# Altium project soldeer.PrjPcb
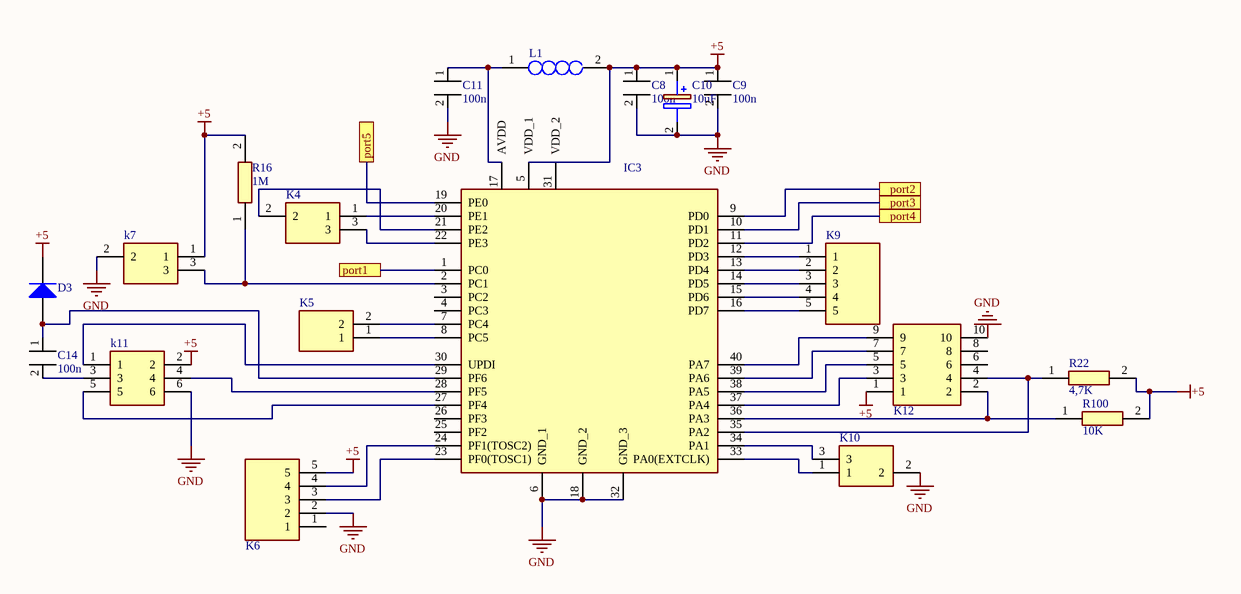
[diagram p0: controller.SchDoc]
4 sheets, 79 parts. Net scope: flat (ports and power ports of the same name join across sheets).
Board file: PCB1.PcbDoc
Sheets:
  controller.SchDoc
  input.SchDoc
  bout.SchDoc
  led.SchDoc

## Sheet controller.SchDoc
size A4; SheetNumber: 1; SheetTotal: 4

### Parts
C8  100n  [FP-CRCW0805-e3-IPC_A]
C9  100n  [FP-CRCW0805-e3-IPC_A]
C10  10uF  [RCE7U2J103J3K1H03B]
C11  100n  [FP-CRCW0805-e3-IPC_A]
C14  100n  [FP-CRCW0805-e3-IPC_A]
D3  1N4148  [NXP-SOD27-2_V]  (value not drawn)
IC3  ATMEGA4809-PF  [DIP1543W58P254L5175H635Q40N]  (value not drawn)
K4  10129380-903001ALF  [10129380903001ALF]  (value not drawn)
K5  M20-9990245  [HDRV2W64P0X254_1X2_508X254X864P]  (value not drawn)
K6  825433-5  [HDRV5W63P0X254_1X5_1270X254X970P]  (value not drawn)
k7  10129380-903001ALF  [10129380903001ALF]  (value not drawn)
K9  825433-5  [HDRV5W63P0X254_1X5_1270X254X970P]  (value not drawn)
K10  10129380-903001ALF  [10129380903001ALF]  (value not drawn)
k11  M22-5320305R  [M225320305R]  (value not drawn)
K12  61201021721  [SHDRRA10W64P254X254_2X5_2036X885X910P]  (value not drawn)
L1  LQM18FN1R0M00D  [LQM18FN100M00D]  (value not drawn)
R16  1M  [FP-CRCW0805-e3-IPC_A]
R22  4,7K  [FP-CRCW0805-e3-IPC_A]
R100  10K  [FP-CRCW0805-e3-IPC_A]

### Ports
port1, port2, port3, port4, port5

### Nets
+5: C8.1(+) C9.1(+) C10.1(+) D3.2(K) K6.5 k7.1 k11.2 K12.1 L1.2 R16.2 R22.2 R100.2
GND: C8.2(-) C9.2(-) C10.2(-) C11.2(-) IC3.6(GND_1) IC3.18(GND_2) IC3.32(GND_3) K6.2 k7.2 K10.2 k11.6 K12.10
NetC6_1: IC3.9(PD0) ; port port2
NetC11_1: C11.1(+) L1.1
NetC12_1: IC3.10(PD1) ; port port3
NetC14_1: C14.1(+) D3.1(A) IC3.29(PF6)
NetC14_2: C14.2(-) k11.3
NetD2_1: IC3.11(PD2) ; port port4
NetIC3_1: IC3.1(PC0) ; port port1
NetIC3_2: IC3.2(PC1) k7.3 R16.1
NetIC3_7: IC3.7(PC4) K5.2
NetIC3_8: IC3.8(PC5) K5.1
NetIC3_12: IC3.12(PD3) K9.1
NetIC3_13: IC3.13(PD4) K9.2
NetIC3_14: IC3.14(PD5) K9.3
NetIC3_15: IC3.15(PD6) K9.4
NetIC3_16: IC3.16(PD7) K9.5
NetIC3_19: IC3.19(PE0) ; port port5
NetIC3_20: IC3.20(PE1) K4.1
NetIC3_21: IC3.21(PE2) K4.2
NetIC3_22: IC3.22(PE3) K4.3
NetIC3_23: IC3.23(PF0(TOSC1)) K6.3
NetIC3_24: IC3.24(PF1(TOSC2)) K6.4
NetIC3_27: IC3.27(PF4) k11.5
NetIC3_28: IC3.28(PF5) k11.4
NetIC3_30: IC3.30(UPDI) k11.1
NetIC3_33: IC3.33(PA0(EXTCLK)) K10.1
NetIC3_34: IC3.34(PA1) K10.3
NetIC3_35: IC3.35(PA2) K12.4 R22.1
NetIC3_36: IC3.36(PA3) K12.2 R100.1
NetIC3_37: IC3.37(PA4) K12.3
NetIC3_38: IC3.38(PA5) K12.5
NetIC3_39: IC3.39(PA6) K12.7
NetIC3_40: IC3.40(PA7) K12.9

Not connected (* = marked no-connect by the designer): IC3 3(PC2) 4(PC3) 5(VDD_1) 17(AVDD) 25(PF2) 26(PF3) 31(VDD_2); K6 1; K12 6 8

### Library data of the parts
C8 C9 C11 C14 = MAL215097101E3: Capacitor Polarised; Manufacturer_Name: Vishay; Datasheet Link: https://componentsearchengine.com/Datasheets/2/MAL215097101E3.pdf; Height: 10.5mm; Manufacturer_Part_Number: MAL215097101E3
C10 = Component_1
D3 = CMP-0648-00002-1: High-speed Diode, 100 V, 450 mA, 2-Pin SOD27, RoHS; Manufacturer: NXP Semiconductors; Configuration: Single; IR (VR: 20 V)=25 nA; IFRM: 450 mA; IFSM: 4 A Max.; Trr: 4 ns Max.; Cd: 4 pF Max.; VR: 100 V Max.; VF (IF: 10 mA)=1 V; IF: 200 mA Max.; ComponentLink1Description: Manufacturer URL; RoHS: TRUE; ComponentLink1URL: http://www.nxp.com/; ComponentLink3Description: Package Specification; DatasheetVersion: Aug-04; ComponentLink2Description: Datasheet; PackageVersion: Aug-04; PackageReference: SOD27; ComponentLink3URL: http://www.nxp.com/documents/data_sheet/1N4148_1N4448.pdf; Mounting Technology: Through Hole; ComponentLink2URL: http://www.nxp.com/documents/data_sheet/1N4148_1N4448.pdf; PartNumber: 1N4148; PackageDescription: 2-Pin Hermetically Sealed Glass Package, Axial Leaded, Dia 1.85 mm, Body Length 4.25 mm, Lead Spread 25.4 mm
IC3 = ATMEGA4809-PF: Integrated Circuit; Manufacturer_Name: Microchip; Datasheet Link: https://componentsearchengine.com//ATMEGA4809-PF.pdf; Height: 6.35mm; Mouser2 Part Number: 556-ATMEGA4809-PF; Mouser2 Price/Stock: https://www.mouser.com/Search/Refine.aspx?Keyword=556-ATMEGA4809-PF; Manufacturer_Part_Number: ATMEGA4809-PF
K4 k7 K10 = 10129380-903001ALF: Connector; Manufacturer_Name: Amphenol; Datasheet Link: https://cdn.amphenol-icc.com/media/wysiwyg/files/documentation/datasheet/boardwiretoboard/bwb_econostik_254headers.pdf; Height: 9.85mm; Manufacturer_Part_Number: 10129380-903001ALF
K5 = M20-9990245: Connector; Manufacturer_Name: Harwin; Datasheet Link: https://componentsearchengine.com//M20-9990245.pdf; Height: 8.64mm; Mouser2 Part Number: 855-M20-9990245; Mouser2 Price/Stock: https://www.mouser.com/Search/Refine.aspx?Keyword=855-M20-9990245; Manufacturer_Part_Number: M20-9990245
K6 K9 = 825433-5: Connector; Manufacturer_Name: TE Connectivity; Datasheet Link: https://componentsearchengine.com//825433-5.pdf; Height: 9.7mm; Mouser2 Part Number: 571-825433-5; Mouser2 Price/Stock: https://www.mouser.com/Search/Refine.aspx?Keyword=571-825433-5; Manufacturer_Part_Number: 825433-5
k11 = M22-5320305R: Connector; Manufacturer_Name: Harwin; Datasheet Link: https://cdn.harwin.com/pdfs/M22-532R.pdf; Height: 7.3mm; Manufacturer_Part_Number: M22-5320305R
K12 = 61201021721: Connector; Manufacturer_Name: Wurth Elektronik; Datasheet Link: https://componentsearchengine.com//61201021721.pdf; Height: 9.1mm; Mouser2 Part Number: 710-61201021721; Mouser2 Price/Stock: https://www.mouser.com/Search/Refine.aspx?Keyword=710-61201021721; Manufacturer_Part_Number: 61201021721
L1 = LQM18FN1R0M00D: Inductor; Manufacturer_Name: Murata Electronics; Datasheet Link: https://psearch.en.murata.com/inductor/product/LQM18FN1R0M00%23.html; Height: 0.9mm; Manufacturer_Part_Number: LQM18FN1R0M00D
R16 R22 R100 = CHP0805AFX-1000ELF: Resistor; Manufacturer_Name: Bourns; Datasheet Link: https://www.mouser.cn/datasheet/2/54/chp-a-1858677.pdf; Height: 0.6mm; Manufacturer_Part_Number: CHP0805AFX-1000ELF

## Sheet input.SchDoc
size A4; SheetNumber: 2; SheetTotal: 4
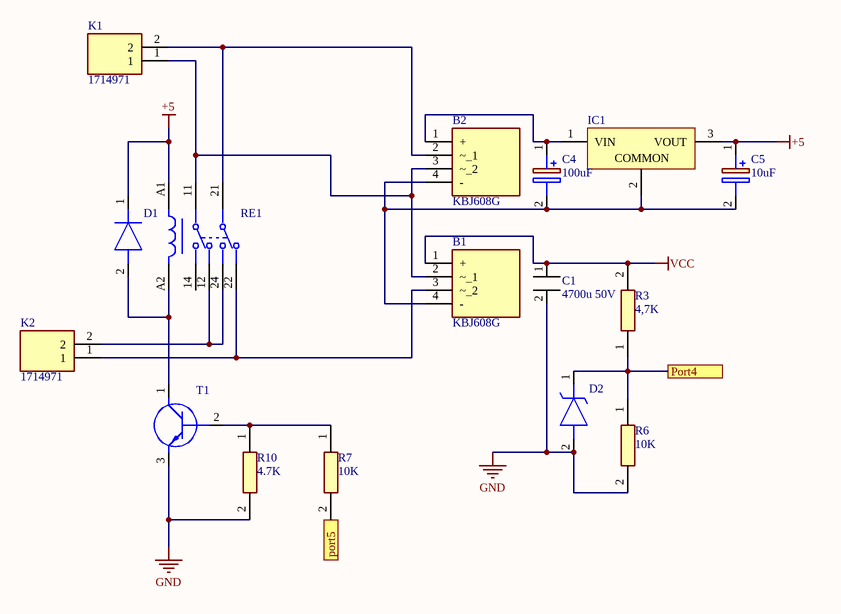
[diagram p1: input.SchDoc]

### Parts
B1  KBJ608G  [TO750P480X2500X1900-4P]
B2  KBJ608G  [TO750P480X2500X1900-4P]
C1  4700u 50V  [CAPPRD1000W80D2200H3700]
C4  100uF  [CAPAE1050X1050N]
C5  10uF  [RCE7U2J103J3K1H03B]
D1  1N4007  [DIOAD1408W86L464D236]  (value not drawn)
D2  TZMC5V1-GS08  [TZMC5V1GS08]  (value not drawn)
IC1  OKI-78SR-5/1.5-W36-C  [MURA-OKI-78SR-3]  (value not drawn)
K1  1714971  [1714971]
K2  1714971  [1714971]
R3  4,7K  [FP-CRCW0805-e3-IPC_A]
R6  10K  [FP-CRCW0805-e3-IPC_A]
R7  10K  [FP-CRCW0805-e3-IPC_A]
R10  4.7K  [FP-CRCW0805-e3-IPC_A]
RE1  RT424005F  [FP-RT424005F-MFG]  (value not drawn)
T1  BC547CBU  [BC547CBU]  (value not drawn)

### Ports
Port4, port5

### Nets
+5: C5.1(+) D1.1(K) IC1.3(VOUT) RE1.A1
GND: C1.2(-) D2.2(A) R6.2 R10.2 T1.3(E)
VCC: B1.1(+) C1.1(+) R3.2
NetB1_2: B1.2(~_1) B2.3(~_2) K1.1 RE1.11
NetB1_3: B1.3(~_2) K2.1 RE1.22
NetB1_4: B1.4(-) B2.4(-) C4.2(-) C5.2(-) IC1.2(COMMON)
NetB2_1: B2.1(+) C4.1(+) IC1.1(VIN)
NetB2_2: B2.2(~_1) K1.2 RE1.21
NetD1_2: D1.2(A) RE1.A2 T1.1(C)
NetD2_1: D2.1(K) R3.1 R6.1 ; port Port4
NetIC3_19: R7.2 ; port port5
NetK2_2: K2.2 RE1.12 RE1.24
NetR7_1: R7.1 R10.1 T1.2(B)

Not connected (* = marked no-connect by the designer): RE1 14

### Library data of the parts
B1 B2 = KBJ608G: Bridge Rectifier; Manufacturer_Name: Diodes Inc.; Datasheet Link: https://componentsearchengine.com//KBJ608G.pdf; Height: 4.8mm; Mouser2 Part Number: 621-KBJ608G; Mouser2 Price/Stock: https://www.mouser.com/Search/Refine.aspx?Keyword=621-KBJ608G; Manufacturer_Part_Number: KBJ608G
C1 C4 = MAL215097101E3: as C8 on sheet controller; Datasheet Link: https://componentsearchengine.com/Datasheets/2/MAL215097101E3.pdf; Height: 10.5mm; Manufacturer_Part_Number: MAL215097101E3
C5 = Component_1
D1 = 1N4007-T: Diode; Manufacturer_Name: Rectron; Datasheet Link: https://componentsearchengine.com//1N4007-T.pdf; Mouser2 Part Number: 583-1N4007-T; Mouser2 Price/Stock: https://www.mouser.com/Search/Refine.aspx?Keyword=583-1N4007-T; Manufacturer_Part_Number: 1N4007-T
D2 = TZMC5V1-GS08: Zener Diode; Manufacturer_Name: Vishay; Datasheet Link: https://componentsearchengine.com/Datasheets/2/TZMC5V1-GS08.pdf; Height: 1.6mm; Manufacturer_Part_Number: TZMC5V1-GS08
IC1 = CMP-2000-05274-1: Non-Isolated DC/DC Converter, 7.5 W, 7 to 36 V, 1.5 A, -40 to 85 degC, 3-Pin THD, RoHS; Manufacturer: Murata; Current - Output (Max): 1.5A; Power (Watts) - Max: 8W; Efficiency: 90.5%; Voltage - Input (Min): 7V; Voltage - Input (Max): 36V; Voltage - Output 1: 5V; Number of Outputs: 1; Package / Case: 3-SIPModule; Features: SCP; Type: LinearRegulatorReplacement; Size / Dimension: 0.41"Lx0.30"Wx0.65"H(10.4mmx7.6mmx16.5mm); Datasheet URL: https://datasheet.ciiva.com/8006/1790439-8006672.pdf; Datasheet Version: Oct-13; Power (Watts) - Manufacture Series: 8W; Voltage - Output 2: -; Series: Okami™OKI-78SR; Family: DCDCConverters; Manufacturer URL: http://www.murata.com/; Category: PowerSupplies-BoardMount; Voltage - Isolation: -; Packaging: Tube; Applications: ITE(Commercial); Mounting Type: ThroughHole; Voltage - Output 3: -; Operating Temperature: -40degC~85degC
K1 K2 = 1714971: Connector; Manufacturer_Name: Phoenix Contact; Datasheet Link: https://componentsearchengine.com/Datasheets/2/1714971.pdf; Height: 21.7mm; Manufacturer_Part_Number: 1714971
R3 R6 R7 R10 = CHP0805AFX-1000ELF: Resistor; Manufacturer_Name: Bourns; Datasheet Link: https://www.mouser.cn/datasheet/2/54/chp-a-1858677.pdf; Height: 0.6mm; Manufacturer_Part_Number: CHP0805AFX-1000ELF
RE1 = CMP-03395-000296-1: RELAY GENERAL PURPOSE DPDT 8A 5V; Power Consumption: 400mW; Coil Current: 80.6mA; Max Voltage Rating (AC): 400V; Coil Power: 500mW; Dropout Voltage: 500mV; Operate Time: 7ms; Contact Voltage Rating (AC): 250V; Coil Type: Non-Latching; Coil Resistance: 62R; Release Time: 3ms; Max Operating Temperature: 85°C; Package Quantity: 5000; Relay Type: General Purpose; Series: RT2; Lead Free: Lead Free; Coil Voltage (DC): 5V; Contact Current Rating: 8A; Packaging: Carton; Height: 15.7mm; Mount: Through Hole; Width: 12.7mm; ELV: Compliant; Termination: PCB; Contact Material: Silver; Throw Configuration: DPDT; Min Operating Temperature: -40°C; Weight: 13g; RoHS Compliant: Yes; Length: 29mm; Radiation Hardening: No
T1 = BC547CBU: Transistor BJT NPN; Manufacturer_Name: ON Semiconductor; Datasheet Link: https://www.onsemi.com/pdf/datasheet/bc550-d.pdf; Height: 5.33mm; Manufacturer_Part_Number: BC547CBU

## Sheet bout.SchDoc
size A4; SheetNumber: 3; SheetTotal: 4
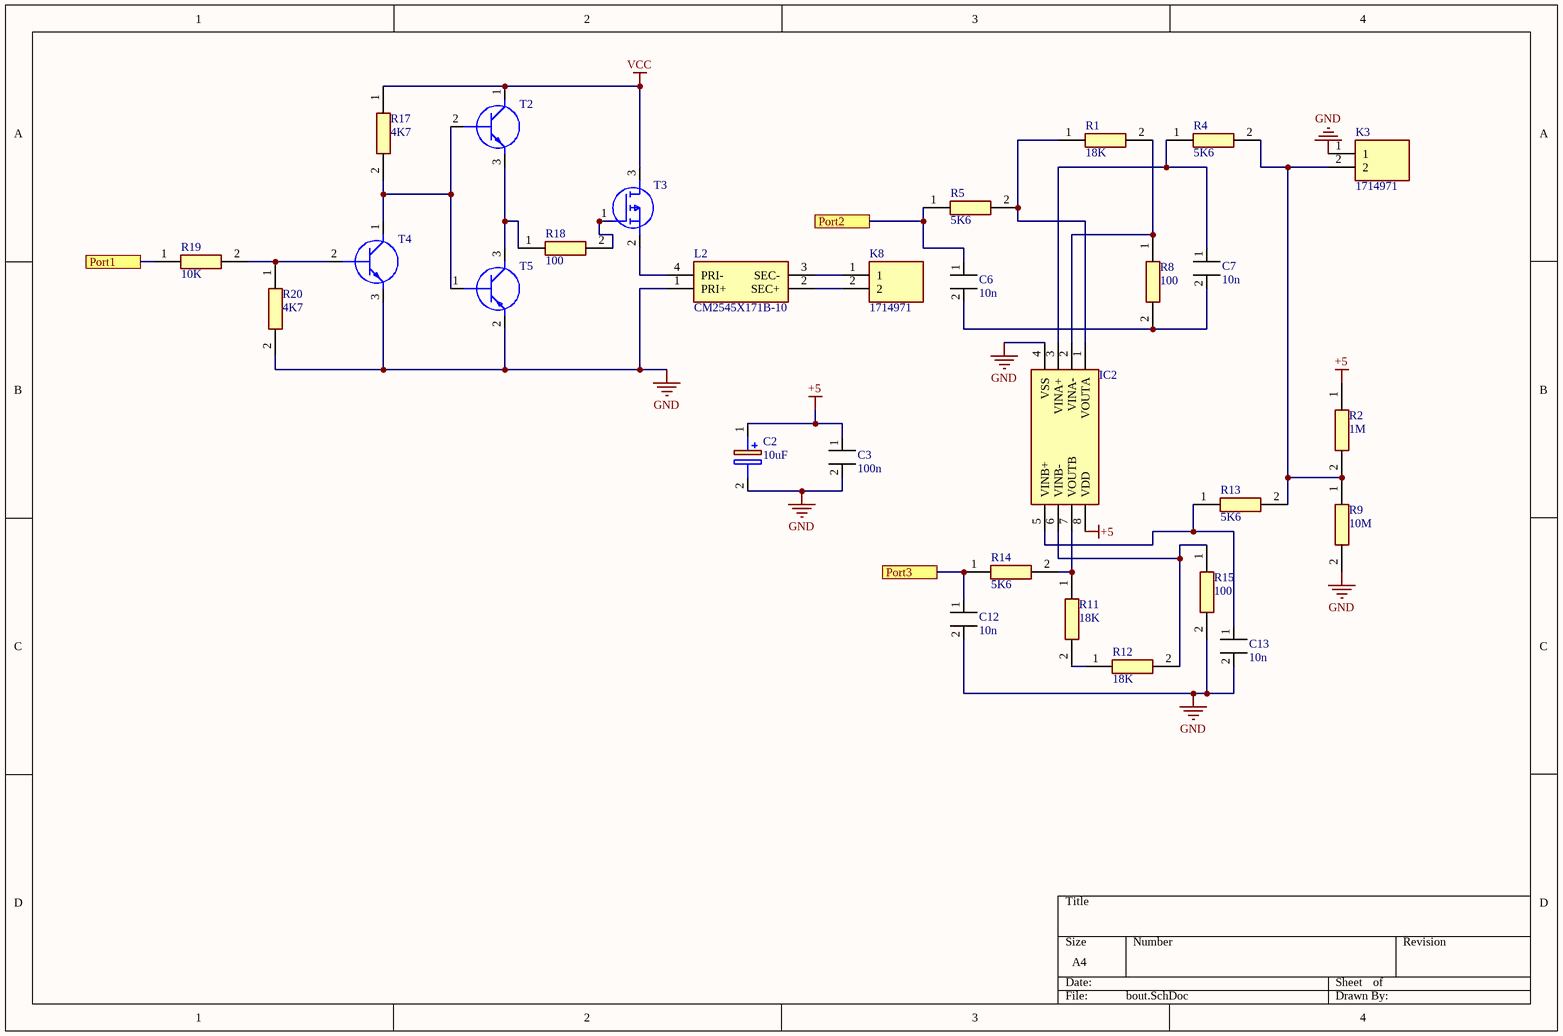
[diagram p2: bout.SchDoc]

### Parts
C2  10uF  [RCE7U2J103J3K1H03B]
C3  100n  [FP-CRCW0805-e3-IPC_A]
C6  10n  [FP-CRCW0805-e3-IPC_A]
C7  10n  [FP-CRCW0805-e3-IPC_A]
C12  10n  [FP-CRCW0805-e3-IPC_A]
C13  10n  [FP-CRCW0805-e3-IPC_A]
IC2  MCP6002-I_P  [DIP781W56P254L950H533Q8N]  (value not drawn)
K3  1714971  [1714971]
K8  1714971  [1714971]
L2  CM2545X171B-10  [CM2545X171B10]
R1  18K  [FP-CRCW0805-e3-IPC_A]
R2  1M  [FP-CRCW0805-e3-IPC_A]
R4  5K6  [FP-CRCW0805-e3-IPC_A]
R5  5K6  [FP-CRCW0805-e3-IPC_A]
R8  100  [FP-CRCW0805-e3-IPC_A]
R9  10M  [FP-CRCW0805-e3-IPC_A]
R11  18K  [FP-CRCW0805-e3-IPC_A]
R12  18K  [FP-CRCW0805-e3-IPC_A]
R13  5K6  [FP-CRCW0805-e3-IPC_A]
R14  5K6  [FP-CRCW0805-e3-IPC_A]
R15  100  [FP-CRCW0805-e3-IPC_A]
R17  4K7  [FP-CRCW0805-e3-IPC_A]
R18  100  [FP-CRCW0805-e3-IPC_A]
R19  10K  [FP-CRCW0805-e3-IPC_A]
R20  4K7  [FP-CRCW0805-e3-IPC_A]
T2  BC547CBU  [BC547CBU]  (value not drawn)
T3  IRF9Z34NPBF  [TO254P469X1042X1967-3P]  (value not drawn)
T4  BC547CBU  [BC547CBU]  (value not drawn)
T5  BCX71K,215  [SOT95P230X110-3N]  (value not drawn)

### Ports
Port1, Port2, Port3

### Nets
+5: C2.1(+) C3.1(+) IC2.8(VDD) R2.1
GND: C2.2(-) C3.2(-) C12.2(-) C13.2(-) IC2.4(VSS) K3.1 L2.1(PRI+) R9.2 R15.2 R20.2 T4.3(E) T5.2(E)
VCC: R17.1 T2.1(C) T3.3(D)
NetC6_1: C6.1(+) R5.1 ; port Port2
NetC6_2: C6.2(-) C7.2(-) R8.2
NetC7_1: C7.1(+) IC2.3(VINA+) R4.1
NetC12_1: C12.1(+) R14.1 ; port Port3
NetC13_1: C13.1(+) IC2.5(VINB+) R13.1
NetIC2_1: IC2.1(VOUTA) R1.1 R5.2
NetIC2_2: IC2.2(VINA-) R1.2 R8.1
NetIC2_6: IC2.6(VINB-) R12.2 R15.1
NetIC2_7: IC2.7(VOUTB) R11.1 R14.2
NetIC3_1: R19.1 ; port Port1
NetK3_2: K3.2 R2.2 R4.2 R9.1 R13.2
NetK8_1: K8.1 L2.3(SEC-)
NetK8_2: K8.2 L2.2(SEC+)
NetL2_4: L2.4(PRI-) T3.2(S)
NetR11_2: R11.2 R12.1
NetR17_2: R17.2 T2.2(B) T4.1(C) T5.1(B)
NetR18_1: R18.1 T2.3(E) T5.3(C)
NetR18_2: R18.2 T3.1(G)
NetR19_2: R19.2 R20.1 T4.2(B)

### Library data of the parts
C2 = Component_1
C3 C6 C7 C12 C13 = MAL215097101E3: as C8 on sheet controller; Datasheet Link: https://componentsearchengine.com/Datasheets/2/MAL215097101E3.pdf; Height: 10.5mm; Manufacturer_Part_Number: MAL215097101E3
IC2 = MCP6002-I_P: Integrated Circuit; Manufacturer_Name: Microchip; Manufacturer_Part_Number: MCP6002-I/P; Datasheet Link: https://componentsearchengine.com//MCP6002-I_P.pdf; Height: 5.334mm; Mouser2 Part Number: 579-MCP6002-I/P; Mouser2 Price/Stock: https://www.mouser.com/Search/Refine.aspx?Keyword=579-MCP6002-I%2FP
K3 K8 = 1714971: as K1 on sheet input; Datasheet Link: https://componentsearchengine.com/Datasheets/2/1714971.pdf; Height: 21.7mm; Manufacturer_Part_Number: 1714971
L2 = CM2545X171B-10: Transformer; Manufacturer_Name: Laird Technologies; Datasheet Link: https://datasheet.datasheetarchive.com/originals/dk/DKDS-7/122753.pdf; Height: 9.5mm; Manufacturer_Part_Number: CM2545X171B-10
R1 R2 R4 R5 R8 R9 R11-R15 R17-R20 = CHP0805AFX-1000ELF: Resistor; Manufacturer_Name: Bourns; Datasheet Link: https://www.mouser.cn/datasheet/2/54/chp-a-1858677.pdf; Height: 0.6mm; Manufacturer_Part_Number: CHP0805AFX-1000ELF
T2 T4 = BC547CBU: as T1 on sheet input; Datasheet Link: https://www.onsemi.com/pdf/datasheet/bc550-d.pdf; Height: 5.33mm; Manufacturer_Part_Number: BC547CBU
T3 = IRF9Z34NPBF: MOSFET (P-Channel); Manufacturer_Name: Infineon; Datasheet Link: https://componentsearchengine.com//IRF9Z34NPBF.pdf; Height: 4.69mm; Mouser2 Part Number: 942-IRF9Z34NPBF; Mouser2 Price/Stock: https://www.mouser.com/Search/Refine.aspx?Keyword=942-IRF9Z34NPBF; Manufacturer_Part_Number: IRF9Z34NPBF
T5 = BCX71K,215: Transistor BJT PNP; Manufacturer_Name: Nexperia; Datasheet Link: http://assets.nexperia.com/documents/data-sheet/BCX71.pdf; Height: 1.1mm; Manufacturer_Part_Number: BCX71K,215

## Sheet led.SchDoc
size A4; SheetNumber: 4; SheetTotal: 4
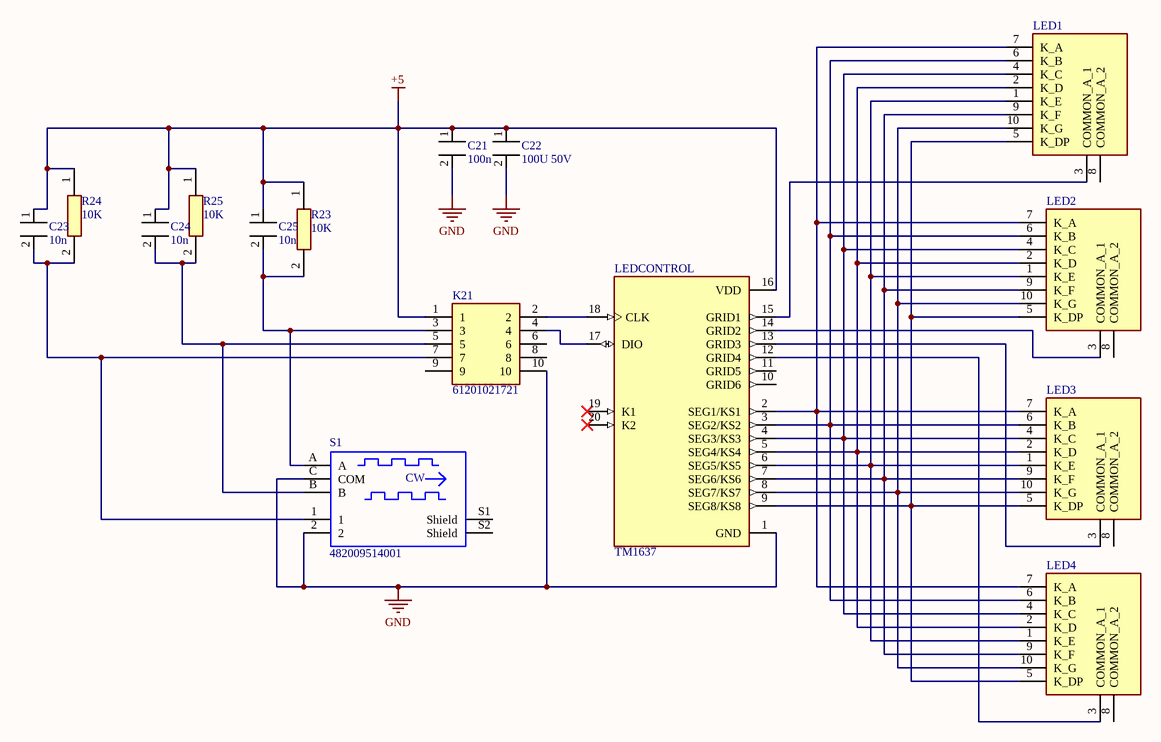
[diagram p3: led.SchDoc]

### Parts
C21  100n  [FP-CRCW0805-e3-IPC_A]
C22  100U 50V  [FP-CRCW0805-e3-IPC_A]
C23  10n  [FP-CRCW0805-e3-IPC_A]
C24  10n  [FP-CRCW0805-e3-IPC_A]
C25  10n  [FP-CRCW0805-e3-IPC_A]
K21  61201021721  [SHDRRA10W64P254X254_2X5_2036X885X910P]
LED1  HDSP-511A  [HDSP511A]  (value not drawn)
LED2  HDSP-511A  [HDSP511A]  (value not drawn)
LED3  HDSP-511A  [HDSP511A]  (value not drawn)
LED4  HDSP-511A  [HDSP511A]  (value not drawn)
LEDCONTROL  TM1637  [DIP778W43P254L2612H431Q20N]
R23  10K  [FP-CRCW0805-e3-IPC_A]
R24  10K  [FP-CRCW0805-e3-IPC_A]
R25  10K  [FP-CRCW0805-e3-IPC_A]
S1  482009514001  [4820xx514001]

### Nets
+5: C21.1(+) C22.1(+) C23.1(+) C24.1(+) C25.1(+) K21.1 LEDCONTROL.16(VDD) R23.1 R24.1 R25.1
GND: C21.2(-) C22.2(-) K21.10 LEDCONTROL.1(GND) S1.2 S1.C(COM)
NetC23_2: C23.2(-) K21.7 R24.2 S1.1
NetC24_2: C24.2(-) K21.5 R25.2 S1.B
NetC25_2: C25.2(-) K21.3 R23.2 S1.A
NetK21_2: K21.2 LEDCONTROL.18(CLK)
NetK21_4: K21.4 LEDCONTROL.17(DIO)
NetLED1_1: LED1.1(K_E) LED2.1(K_E) LED3.1(K_E) LED4.1(K_E) LEDCONTROL.6(SEG5/KS5)
NetLED1_2: LED1.2(K_D) LED2.2(K_D) LED3.2(K_D) LED4.2(K_D) LEDCONTROL.5(SEG4/KS4)
NetLED1_3: LED1.3(COMMON_A_1) LEDCONTROL.15(GRID1)
NetLED1_4: LED1.4(K_C) LED2.4(K_C) LED3.4(K_C) LED4.4(K_C) LEDCONTROL.4(SEG3/KS3)
NetLED1_5: LED1.5(K_DP) LED2.5(K_DP) LED3.5(K_DP) LED4.5(K_DP) LEDCONTROL.9(SEG8/KS8)
NetLED1_6: LED1.6(K_B) LED2.6(K_B) LED3.6(K_B) LED4.6(K_B) LEDCONTROL.3(SEG2/KS2)
NetLED1_7: LED1.7(K_A) LED2.7(K_A) LED3.7(K_A) LED4.7(K_A) LEDCONTROL.2(SEG1/KS1)
NetLED1_9: LED1.9(K_F) LED2.9(K_F) LED3.9(K_F) LED4.9(K_F) LEDCONTROL.7(SEG6/KS6)
NetLED1_10: LED1.10(K_G) LED2.10(K_G) LED3.10(K_G) LED4.10(K_G) LEDCONTROL.8(SEG7/KS7)
NetLED2_3: LED2.3(COMMON_A_1) LEDCONTROL.14(GRID2)
NetLED3_3: LED3.3(COMMON_A_1) LEDCONTROL.13(GRID3)
NetLED4_3: LED4.3(COMMON_A_1) LEDCONTROL.12(GRID4)

Not connected (* = marked no-connect by the designer): K21 6 8 9; LED1 8(COMMON_A_2); LED2 8(COMMON_A_2); LED3 8(COMMON_A_2); LED4 8(COMMON_A_2); LEDCONTROL 10(GRID6) 11(GRID5) 19(K1)* 20(K2)*; S1 S1(Shield) S2(Shield)

### Notes on the sheet
- (in symbol 482009514001) CW

### Library data of the parts
C21-C25 = MAL215097101E3: as C8 on sheet controller; Datasheet Link: https://componentsearchengine.com/Datasheets/2/MAL215097101E3.pdf; Height: 10.5mm; Manufacturer_Part_Number: MAL215097101E3
K21 = 61201021721: as K12 on sheet controller; Datasheet Link: https://componentsearchengine.com//61201021721.pdf; Height: 9.1mm; Mouser2 Part Number: 710-61201021721; Mouser2 Price/Stock: https://www.mouser.com/Search/Refine.aspx?Keyword=710-61201021721; Manufacturer_Part_Number: 61201021721
LED1-LED4 = HDSP-511A: Display; Manufacturer_Name: Avago Technologies; Datasheet Link: https://datasheet.datasheetarchive.com/originals/distributors/SFDatasheet-4/sf-00083626.pdf; Height: 8mm; Mouser2 Part Number: 630-HDSP-511A; Mouser2 Price/Stock: https://www.mouser.com/Search/Refine.aspx?Keyword=630-HDSP-511A; Manufacturer_Part_Number: HDSP-511A
LEDCONTROL = TM1637: LED Drive Control Special Circuit; MF: Titan Micro Electronics; Package: Package; Availability: Not in stock; SnapEDA_Link: https://www.snapeda.com/parts/TM1637/Titan+Micro+Electronics/view-part/?ref=snap; MP: TM1637; Check_prices: https://www.snapeda.com/parts/TM1637/Titan+Micro+Electronics/view-part/?ref=eda; Value: *; Price: None
R23-R25 = CHP0805AFX-1000ELF: Resistor; Manufacturer_Name: Bourns; Datasheet Link: https://www.mouser.cn/datasheet/2/54/chp-a-1858677.pdf; Height: 0.6mm; Manufacturer_Part_Number: CHP0805AFX-1000ELF
S1 = 482009514001: WS-ENTV Mechanical Incremental Encoder Switch, Metal Shaft with bushing, 8Pulse/360deg, 16positions, 10mA; Manufacturer: Wurth Elektronik; Electrical Life Switch: 20000Cycles; Electrical Life Encoder: 15000Cycles; Insulation Resistance: 100MOhm; Operation Force: 600g; ComponentLink1Description: Manufacturer; ComponentLink1URL: http://www.we-online.de; ComponentLink2Description: Datasheet; ComponentLink2URL: https://www.we-online.com/catalog/datasheet/482009514001.pdf; Mounting Technology: THT; Manufacturer Part Number: 482009514001; Published Date: May 2021; Detent: 16positions; Operating Temperature: -40 to +85degC; Packaging: Tray; Resolution: 8Pulse/360deg; Rated Current: 10mA; Size: L13.75W11.7H26.6

## Nets that join several sheets
+5: controller (12 pins), input (C5.1 D1.1 IC1.3 RE1.A1), bout (C2.1 C3.1 IC2.8 R2.1), led (10 pins)
GND: controller (12 pins), input (5 pins), bout (12 pins), led (6 pins)
VCC: input (B1.1 C1.1 R3.2), bout (R17.1 T2.1 T3.3)
NetC6_1: controller (IC3.9), bout (C6.1 R5.1)
NetC12_1: controller (IC3.10), bout (C12.1 R14.1)
NetD2_1: controller (IC3.11), input (D2.1 R3.1 R6.1)
NetIC3_1: controller (IC3.1), bout (R19.1)
NetIC3_19: controller (IC3.19), input (R7.2)